# Altium schematic sheet schematic.SchDoc
size A4; DocumentNumber: 1; SheetNumber: 1; SheetTotal: 5
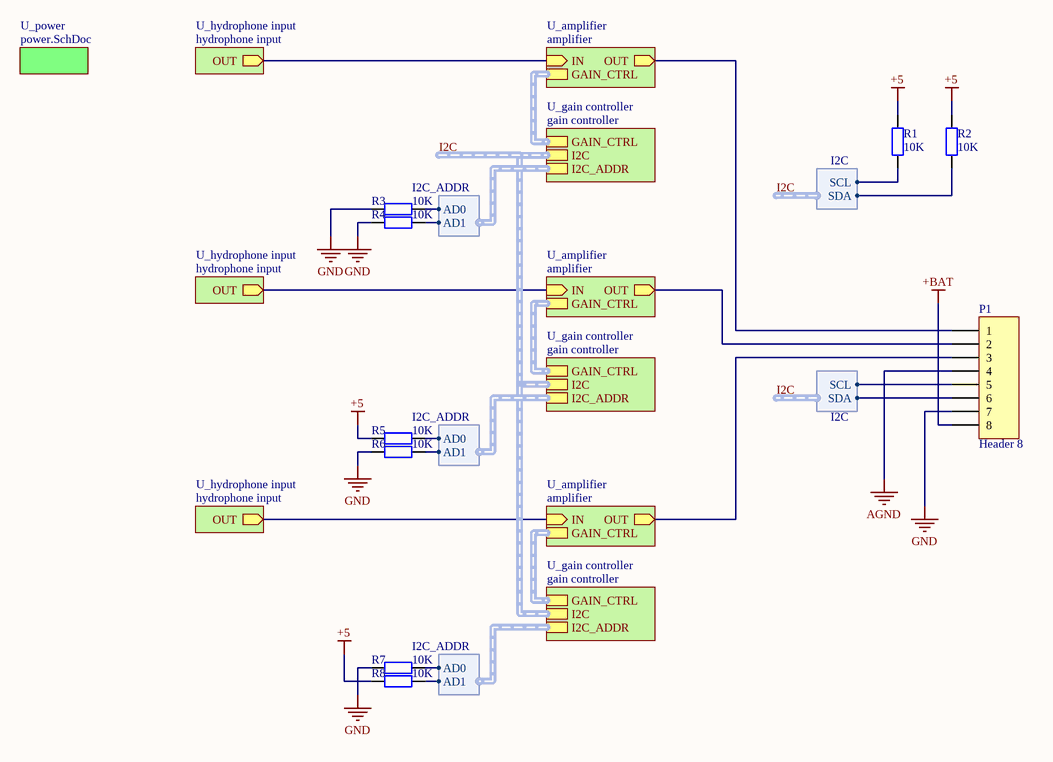
[diagram p0: schematic.SchDoc]

## Parts
P1  Header 8  [HDR1X8]
R1  value 10K  [R0603]  (hidden comment: Res2)
R2  value 10K  [R0603]  (hidden comment: Res2)
R3  value 10K  [R0603]  (hidden comment: Res2)
R4  value 10K  [R0603]  (hidden comment: Res2)
R5  value 10K  [R0603]  (hidden comment: Res2)
R6  value 10K  [R0603]  (hidden comment: Res2)
R7  value 10K  [R0603]  (hidden comment: Res2)
R8  value 10K  [R0603]  (hidden comment: Res2)

## Sub-sheets
U_amplifier = amplifier: IN (in), OUT (out), GAIN_CTRL (harness NON_INVERTING_GAIN_CONTROL)
U_amplifier = amplifier: IN (in), OUT (out), GAIN_CTRL (harness NON_INVERTING_GAIN_CONTROL)
U_amplifier = amplifier: IN (in), OUT (out), GAIN_CTRL (harness NON_INVERTING_GAIN_CONTROL)
U_gain controller = gain controller: GAIN_CTRL (harness NON_INVERTING_GAIN_CONTROL), I2C (harness I2C), I2C_ADDR (harness I2C_ADDR)
U_gain controller = gain controller: GAIN_CTRL (harness NON_INVERTING_GAIN_CONTROL), I2C (harness I2C), I2C_ADDR (harness I2C_ADDR)
U_gain controller = gain controller: GAIN_CTRL (harness NON_INVERTING_GAIN_CONTROL), I2C (harness I2C), I2C_ADDR (harness I2C_ADDR)
U_hydrophone input = hydrophone input: OUT (out)
U_hydrophone input = hydrophone input: OUT (out)
U_hydrophone input = hydrophone input: OUT (out)
U_power = power.SchDoc: no entries

## Harnesses
I2C_ADDR: AD0, AD1
I2C: SCL, SDA

## Nets
+5: R1.2 R2.2 R5.1 R8.1
+BAT: P1.8
AGND: P1.4
GND: P1.7 R3.1 R4.1 R6.1 R7.1
I2C.SCL: P1.5 R1.1 ; sheet U_gain controller/I2C.SCL
I2C.SDA: P1.6 R2.1 ; sheet U_gain controller/I2C.SDA
NetP1_1: P1.1 ; sheet U_amplifier/OUT
NetP1_2: P1.2 ; sheet U_amplifier/OUT
NetP1_3: P1.3 ; sheet U_amplifier/OUT
NetR3_2: R3.2 ; sheet U_gain controller/I2C_ADDR.AD0
NetR4_2: R4.2 ; sheet U_gain controller/I2C_ADDR.AD1
NetR5_2: R5.2 ; sheet U_gain controller/I2C_ADDR.AD0
NetR6_2: R6.2 ; sheet U_gain controller/I2C_ADDR.AD1
NetR7_2: R7.2 ; sheet U_gain controller/I2C_ADDR.AD0
NetR8_2: R8.2 ; sheet U_gain controller/I2C_ADDR.AD1
(unnamed): sheet U_amplifier/IN, sheet U_hydrophone input/OUT
(unnamed): sheet U_amplifier/IN, sheet U_hydrophone input/OUT
(unnamed): sheet U_amplifier/IN, sheet U_hydrophone input/OUT

## Buses and harness runs
harness I2C = sheet U_gain controller/I2C
harness sheet U_amplifier/GAIN_CTRL = sheet U_gain controller/GAIN_CTRL

## Library data of the parts
P1 = Header 8: Header, 8-Pin; LatestRevisionDate: 17-Jul-2002; LatestRevisionNote: Re-released for DXP Platform.; Publisher: Altium Limited
R1-R8 = Res2: Resistor; Published: 8-Jun-2000; LatestRevisionDate: 17-Jul-2002; LatestRevisionNote: Re-released for DXP Platform.; PackageReference: AXIAL-0.4; Publisher: Altium Limited; farnell: 9330399